# EAGLE design light_160mm_v1_0 (EAGLE 9.6.1)
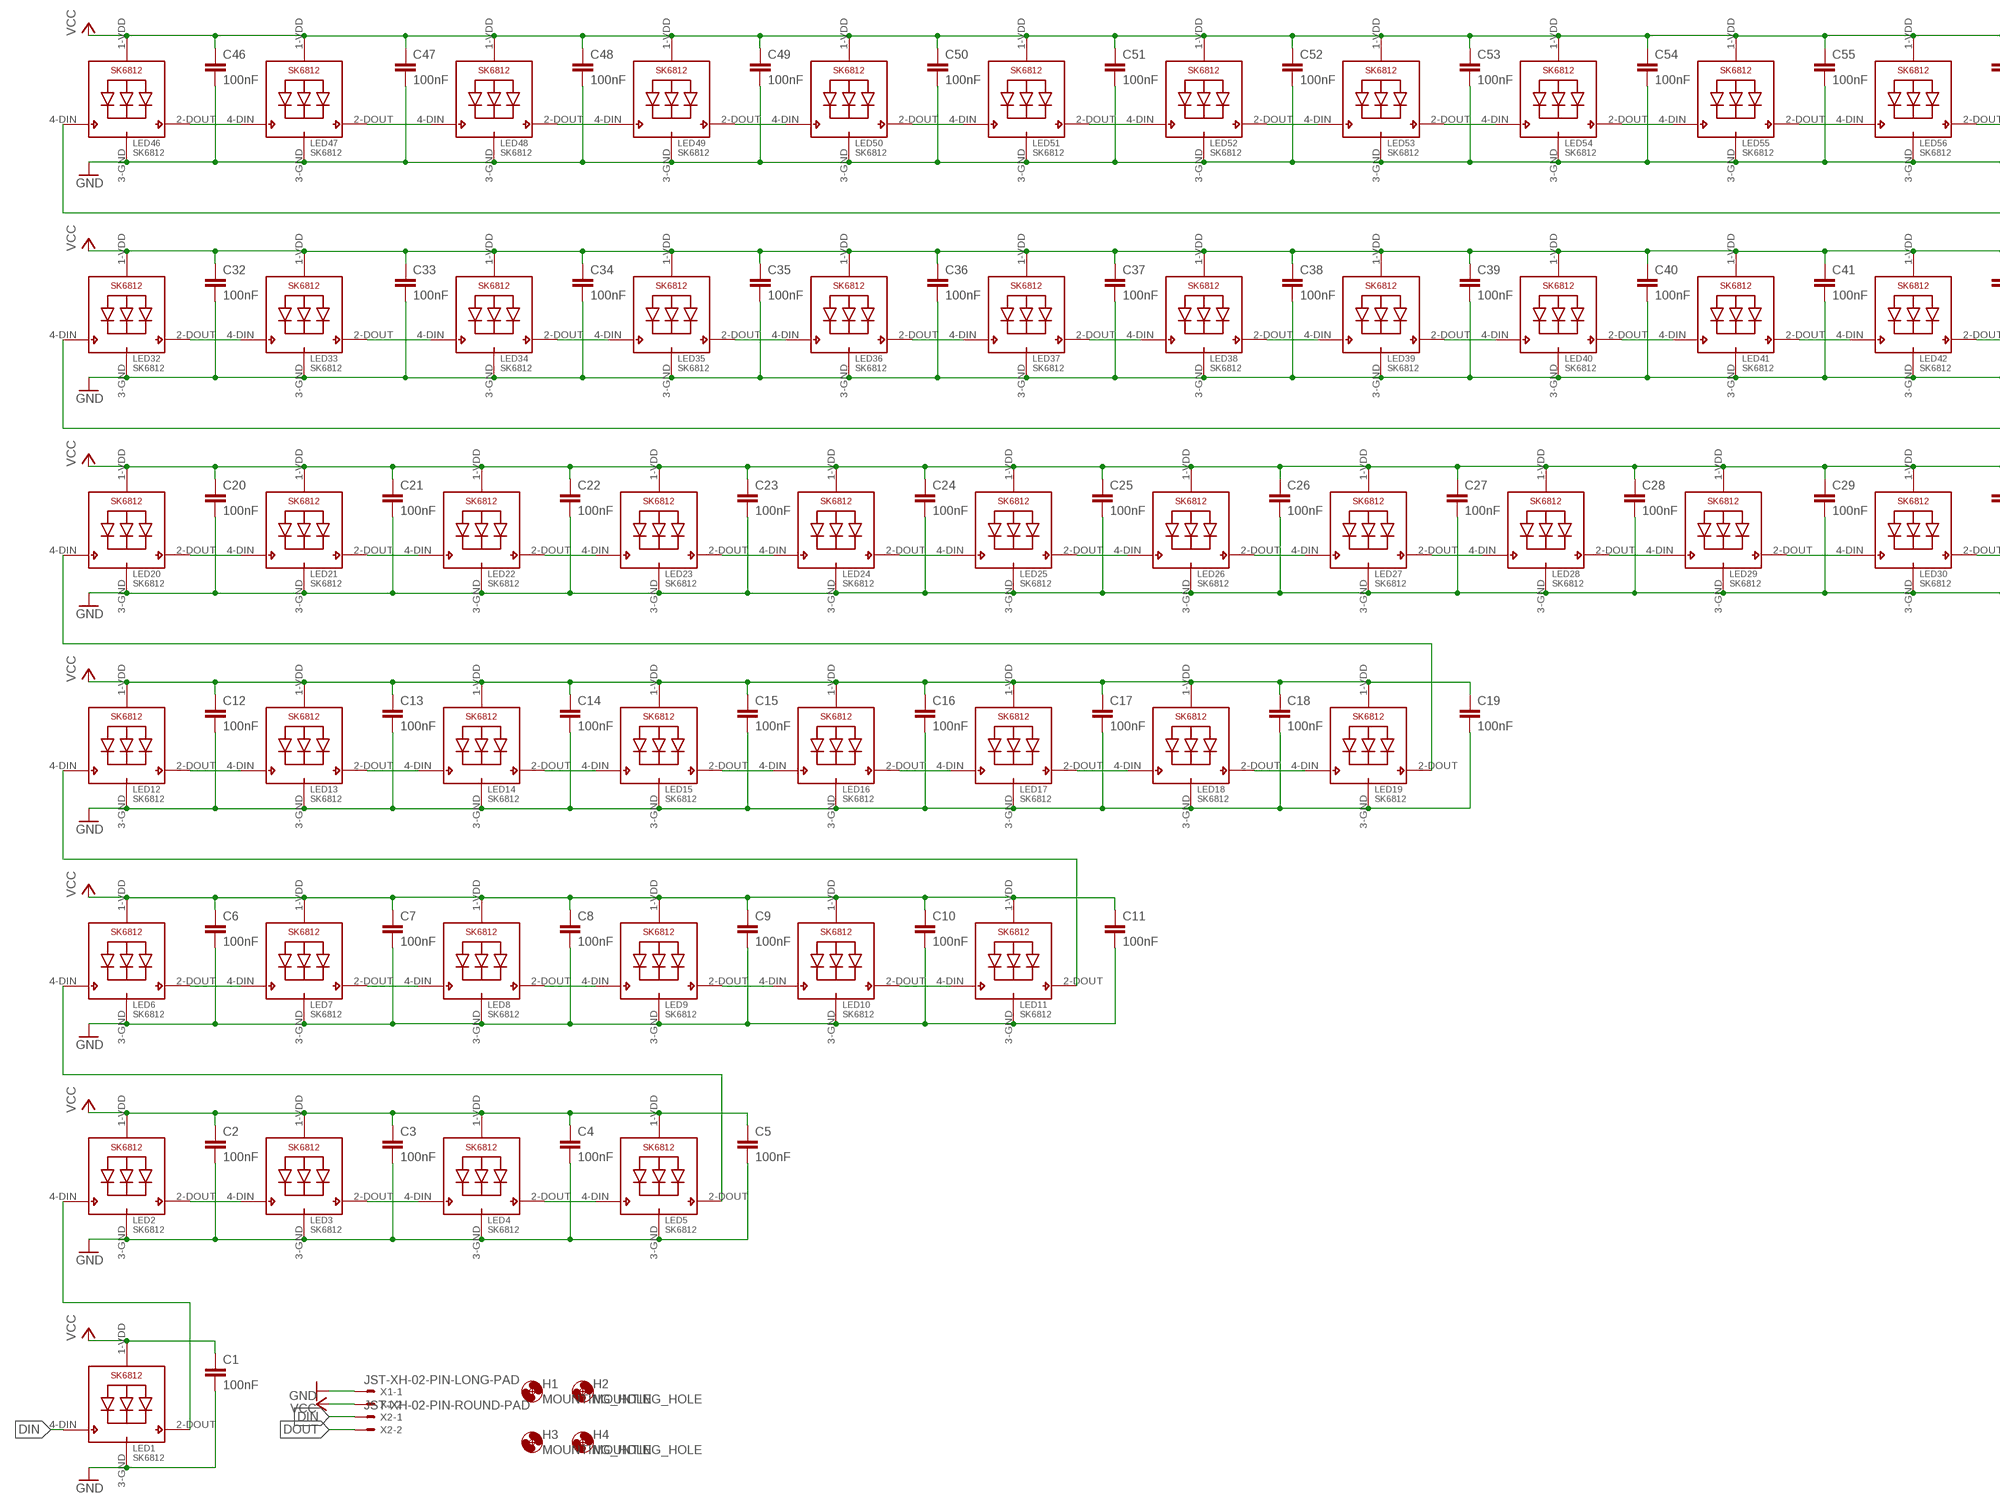
[diagram p0: schematic, sheet 1, part 1 of 2]
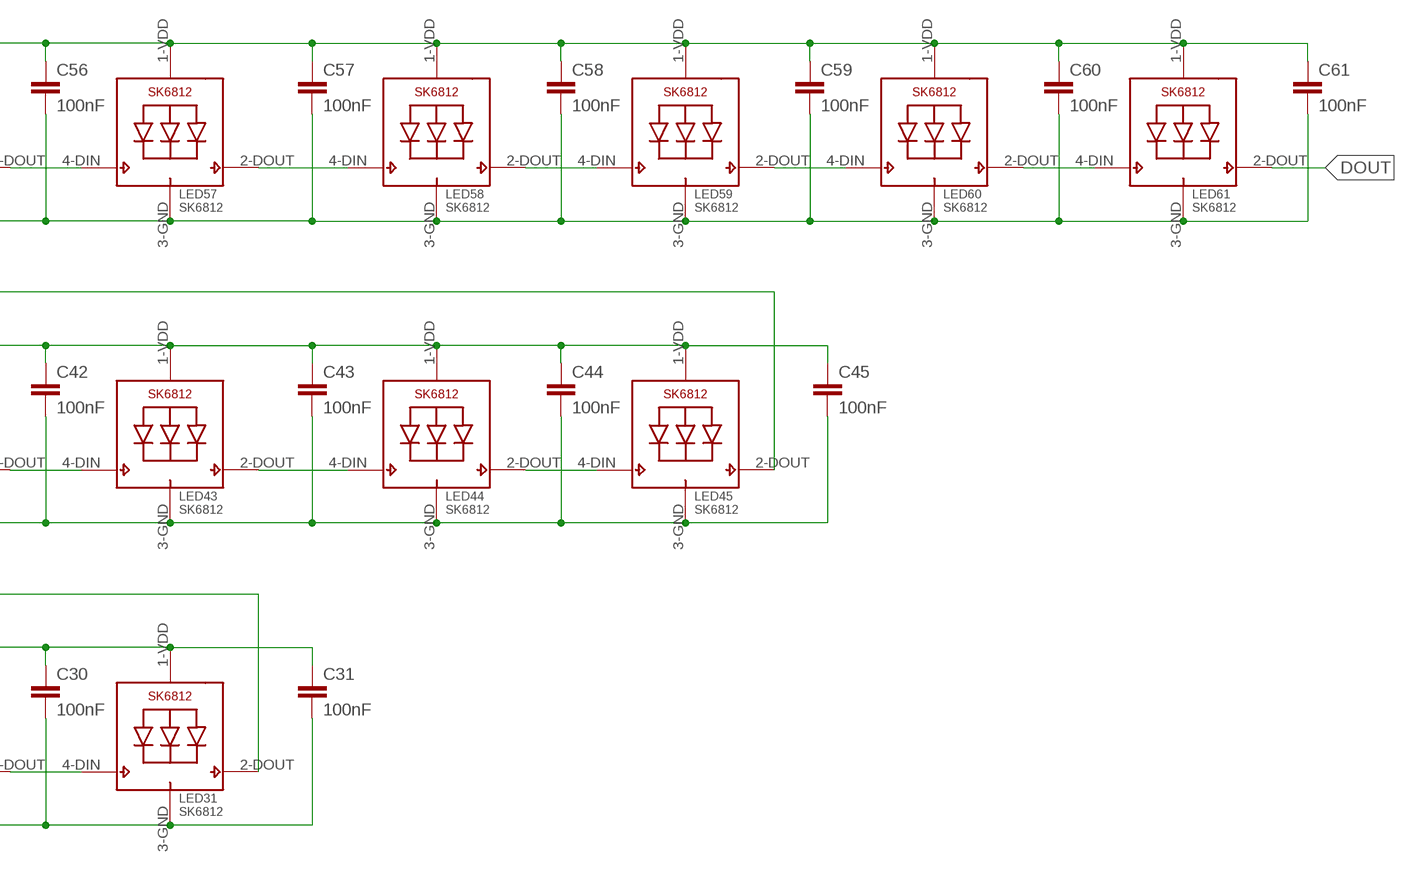
[diagram p1: schematic, sheet 1, part 2 of 2]

## Parts
C1  100nF  C-EUC0805  [C0805]
C2  100nF  C-EUC0805  [C0805]
C3  100nF  C-EUC0805  [C0805]
C4  100nF  C-EUC0805  [C0805]
C5  100nF  C-EUC0805  [C0805]
C6  100nF  C-EUC0805  [C0805]
C7  100nF  C-EUC0805  [C0805]
C8  100nF  C-EUC0805  [C0805]
C9  100nF  C-EUC0805  [C0805]
C10  100nF  C-EUC0805  [C0805]
C11  100nF  C-EUC0805  [C0805]
C12  100nF  C-EUC0805  [C0805]
C13  100nF  C-EUC0805  [C0805]
C14  100nF  C-EUC0805  [C0805]
C15  100nF  C-EUC0805  [C0805]
C16  100nF  C-EUC0805  [C0805]
C17  100nF  C-EUC0805  [C0805]
C18  100nF  C-EUC0805  [C0805]
C19  100nF  C-EUC0805  [C0805]
C20  100nF  C-EUC0805  [C0805]
C21  100nF  C-EUC0805  [C0805]
C22  100nF  C-EUC0805  [C0805]
C23  100nF  C-EUC0805  [C0805]
C24  100nF  C-EUC0805  [C0805]
C25  100nF  C-EUC0805  [C0805]
C26  100nF  C-EUC0805  [C0805]
C27  100nF  C-EUC0805  [C0805]
C28  100nF  C-EUC0805  [C0805]
C29  100nF  C-EUC0805  [C0805]
C30  100nF  C-EUC0805  [C0805]
C31  100nF  C-EUC0805  [C0805]
C32  100nF  C-EUC0805  [C0805]
C33  100nF  C-EUC0805  [C0805]
C34  100nF  C-EUC0805  [C0805]
C35  100nF  C-EUC0805  [C0805]
C36  100nF  C-EUC0805  [C0805]
C37  100nF  C-EUC0805  [C0805]
C38  100nF  C-EUC0805  [C0805]
C39  100nF  C-EUC0805  [C0805]
C40  100nF  C-EUC0805  [C0805]
C41  100nF  C-EUC0805  [C0805]
C42  100nF  C-EUC0805  [C0805]
C43  100nF  C-EUC0805  [C0805]
C44  100nF  C-EUC0805  [C0805]
C45  100nF  C-EUC0805  [C0805]
C46  100nF  C-EUC0805  [C0805]
C47  100nF  C-EUC0805  [C0805]
C48  100nF  C-EUC0805  [C0805]
C49  100nF  C-EUC0805  [C0805]
C50  100nF  C-EUC0805  [C0805]
C51  100nF  C-EUC0805  [C0805]
C52  100nF  C-EUC0805  [C0805]
C53  100nF  C-EUC0805  [C0805]
C54  100nF  C-EUC0805  [C0805]
C55  100nF  C-EUC0805  [C0805]
C56  100nF  C-EUC0805  [C0805]
C57  100nF  C-EUC0805  [C0805]
C58  100nF  C-EUC0805  [C0805]
C59  100nF  C-EUC0805  [C0805]
C60  100nF  C-EUC0805  [C0805]
C61  100nF  C-EUC0805  [C0805]
H1  MOUNTING_HOLE  [4,1]
H2  MOUNTING_HOLE  [4,1]
H3  MOUNTING_HOLE  [4,1]
H4  MOUNTING_HOLE  [4,1]
LED1  SK6812  SK6812_5050  [LED5050]
LED2  SK6812  SK6812_5050  [LED5050]
LED3  SK6812  SK6812_5050  [LED5050]
LED4  SK6812  SK6812_5050  [LED5050]
LED5  SK6812  SK6812_5050  [LED5050]
LED6  SK6812  SK6812_5050  [LED5050]
LED7  SK6812  SK6812_5050  [LED5050]
LED8  SK6812  SK6812_5050  [LED5050]
LED9  SK6812  SK6812_5050  [LED5050]
LED10  SK6812  SK6812_5050  [LED5050]
LED11  SK6812  SK6812_5050  [LED5050]
LED12  SK6812  SK6812_5050  [LED5050]
LED13  SK6812  SK6812_5050  [LED5050]
LED14  SK6812  SK6812_5050  [LED5050]
LED15  SK6812  SK6812_5050  [LED5050]
LED16  SK6812  SK6812_5050  [LED5050]
LED17  SK6812  SK6812_5050  [LED5050]
LED18  SK6812  SK6812_5050  [LED5050]
LED19  SK6812  SK6812_5050  [LED5050]
LED20  SK6812  SK6812_5050  [LED5050]
LED21  SK6812  SK6812_5050  [LED5050]
LED22  SK6812  SK6812_5050  [LED5050]
LED23  SK6812  SK6812_5050  [LED5050]
LED24  SK6812  SK6812_5050  [LED5050]
LED25  SK6812  SK6812_5050  [LED5050]
LED26  SK6812  SK6812_5050  [LED5050]
LED27  SK6812  SK6812_5050  [LED5050]
LED28  SK6812  SK6812_5050  [LED5050]
LED29  SK6812  SK6812_5050  [LED5050]
LED30  SK6812  SK6812_5050  [LED5050]
LED31  SK6812  SK6812_5050  [LED5050]
LED32  SK6812  SK6812_5050  [LED5050]
LED33  SK6812  SK6812_5050  [LED5050]
LED34  SK6812  SK6812_5050  [LED5050]
LED35  SK6812  SK6812_5050  [LED5050]
LED36  SK6812  SK6812_5050  [LED5050]
LED37  SK6812  SK6812_5050  [LED5050]
LED38  SK6812  SK6812_5050  [LED5050]
LED39  SK6812  SK6812_5050  [LED5050]
LED40  SK6812  SK6812_5050  [LED5050]
LED41  SK6812  SK6812_5050  [LED5050]
LED42  SK6812  SK6812_5050  [LED5050]
LED43  SK6812  SK6812_5050  [LED5050]
LED44  SK6812  SK6812_5050  [LED5050]
LED45  SK6812  SK6812_5050  [LED5050]
LED46  SK6812  SK6812_5050  [LED5050]
LED47  SK6812  SK6812_5050  [LED5050]
LED48  SK6812  SK6812_5050  [LED5050]
LED49  SK6812  SK6812_5050  [LED5050]
LED50  SK6812  SK6812_5050  [LED5050]
LED51  SK6812  SK6812_5050  [LED5050]
LED52  SK6812  SK6812_5050  [LED5050]
LED53  SK6812  SK6812_5050  [LED5050]
LED54  SK6812  SK6812_5050  [LED5050]
LED55  SK6812  SK6812_5050  [LED5050]
LED56  SK6812  SK6812_5050  [LED5050]
LED57  SK6812  SK6812_5050  [LED5050]
LED58  SK6812  SK6812_5050  [LED5050]
LED59  SK6812  SK6812_5050  [LED5050]
LED60  SK6812  SK6812_5050  [LED5050]
LED61  SK6812  SK6812_5050  [LED5050]
X1  JST-XH-02-PIN-LONG-PAD  [JST-XH-02-PACKAGE-LONG-PAD]
X2  JST-XH-02-PIN-ROUND-PAD  [JST-XH-02-PACKAGE-ROUND-PAD]

## Nets
DIN: LED1.4-DIN(DI) X2.1
DOUT: LED61.2-DOUT(DO) X2.2
GND: C1.2 C2.2 C3.2 C4.2 C5.2 C6.2 C7.2 C8.2 C9.2 C10.2 C11.2 C12.2 C13.2 C14.2 C15.2 C16.2 C17.2 C18.2 C19.2 C20.2 C21.2 C22.2 C23.2 C24.2 C25.2 C26.2 C27.2 C28.2 C29.2 C30.2 C31.2 C32.2 C33.2 C34.2 C35.2 C36.2 C37.2 C38.2 C39.2 C40.2 C41.2 C42.2 C43.2 C44.2 C45.2 C46.2 C47.2 C48.2 C49.2 C50.2 C51.2 C52.2 C53.2 C54.2 C55.2 C56.2 C57.2 C58.2 C59.2 C60.2 C61.2 LED1.3-GND(GND) LED2.3-GND(GND) LED3.3-GND(GND) LED4.3-GND(GND) LED5.3-GND(GND) LED6.3-GND(GND) LED7.3-GND(GND) LED8.3-GND(GND) LED9.3-GND(GND) LED10.3-GND(GND) LED11.3-GND(GND) LED12.3-GND(GND) LED13.3-GND(GND) LED14.3-GND(GND) LED15.3-GND(GND) LED16.3-GND(GND) LED17.3-GND(GND) LED18.3-GND(GND) LED19.3-GND(GND) LED20.3-GND(GND) LED21.3-GND(GND) LED22.3-GND(GND) LED23.3-GND(GND) LED24.3-GND(GND) LED25.3-GND(GND) LED26.3-GND(GND) LED27.3-GND(GND) LED28.3-GND(GND) LED29.3-GND(GND) LED30.3-GND(GND) LED31.3-GND(GND) LED32.3-GND(GND) LED33.3-GND(GND) LED34.3-GND(GND) LED35.3-GND(GND) LED36.3-GND(GND) LED37.3-GND(GND) LED38.3-GND(GND) LED39.3-GND(GND) LED40.3-GND(GND) LED41.3-GND(GND) LED42.3-GND(GND) LED43.3-GND(GND) LED44.3-GND(GND) LED45.3-GND(GND) LED46.3-GND(GND) LED47.3-GND(GND) LED48.3-GND(GND) LED49.3-GND(GND) LED50.3-GND(GND) LED51.3-GND(GND) LED52.3-GND(GND) LED53.3-GND(GND) LED54.3-GND(GND) LED55.3-GND(GND) LED56.3-GND(GND) LED57.3-GND(GND) LED58.3-GND(GND) LED59.3-GND(GND) LED60.3-GND(GND) LED61.3-GND(GND) X1.1
N$1: LED46.2-DOUT(DO) LED47.4-DIN(DI)
N$2: LED47.2-DOUT(DO) LED48.4-DIN(DI)
N$3: LED48.2-DOUT(DO) LED49.4-DIN(DI)
N$4: LED49.2-DOUT(DO) LED50.4-DIN(DI)
N$5: LED50.2-DOUT(DO) LED51.4-DIN(DI)
N$6: LED51.2-DOUT(DO) LED52.4-DIN(DI)
N$7: LED52.2-DOUT(DO) LED53.4-DIN(DI)
N$8: LED53.2-DOUT(DO) LED54.4-DIN(DI)
N$9: LED54.2-DOUT(DO) LED55.4-DIN(DI)
N$10: LED55.2-DOUT(DO) LED56.4-DIN(DI)
N$11: LED56.2-DOUT(DO) LED57.4-DIN(DI)
N$12: LED57.2-DOUT(DO) LED58.4-DIN(DI)
N$13: LED58.2-DOUT(DO) LED59.4-DIN(DI)
N$14: LED59.2-DOUT(DO) LED60.4-DIN(DI)
N$23: LED60.2-DOUT(DO) LED61.4-DIN(DI)
N$24: LED11.2-DOUT(DO) LED12.4-DIN(DI)
N$25: LED32.2-DOUT(DO) LED33.4-DIN(DI)
N$26: LED33.2-DOUT(DO) LED34.4-DIN(DI)
N$27: LED34.2-DOUT(DO) LED35.4-DIN(DI)
N$28: LED35.2-DOUT(DO) LED36.4-DIN(DI)
N$29: LED36.2-DOUT(DO) LED37.4-DIN(DI)
N$30: LED37.2-DOUT(DO) LED38.4-DIN(DI)
N$31: LED38.2-DOUT(DO) LED39.4-DIN(DI)
N$32: LED39.2-DOUT(DO) LED40.4-DIN(DI)
N$33: LED40.2-DOUT(DO) LED41.4-DIN(DI)
N$34: LED41.2-DOUT(DO) LED42.4-DIN(DI)
N$35: LED42.2-DOUT(DO) LED43.4-DIN(DI)
N$36: LED43.2-DOUT(DO) LED44.4-DIN(DI)
N$37: LED44.2-DOUT(DO) LED45.4-DIN(DI)
N$38: LED19.2-DOUT(DO) LED20.4-DIN(DI)
N$39: LED20.2-DOUT(DO) LED21.4-DIN(DI)
N$40: LED21.2-DOUT(DO) LED22.4-DIN(DI)
N$41: LED22.2-DOUT(DO) LED23.4-DIN(DI)
N$42: LED23.2-DOUT(DO) LED24.4-DIN(DI)
N$43: LED24.2-DOUT(DO) LED25.4-DIN(DI)
N$44: LED25.2-DOUT(DO) LED26.4-DIN(DI)
N$45: LED26.2-DOUT(DO) LED27.4-DIN(DI)
N$46: LED27.2-DOUT(DO) LED28.4-DIN(DI)
N$47: LED28.2-DOUT(DO) LED29.4-DIN(DI)
N$48: LED29.2-DOUT(DO) LED30.4-DIN(DI)
N$49: LED30.2-DOUT(DO) LED31.4-DIN(DI)
N$50: LED31.2-DOUT(DO) LED32.4-DIN(DI)
N$51: LED12.2-DOUT(DO) LED13.4-DIN(DI)
N$52: LED13.2-DOUT(DO) LED14.4-DIN(DI)
N$53: LED14.2-DOUT(DO) LED15.4-DIN(DI)
N$54: LED15.2-DOUT(DO) LED16.4-DIN(DI)
N$55: LED16.2-DOUT(DO) LED17.4-DIN(DI)
N$56: LED17.2-DOUT(DO) LED18.4-DIN(DI)
N$57: LED18.2-DOUT(DO) LED19.4-DIN(DI)
N$58: LED45.2-DOUT(DO) LED46.4-DIN(DI)
N$59: LED6.2-DOUT(DO) LED7.4-DIN(DI)
N$60: LED7.2-DOUT(DO) LED8.4-DIN(DI)
N$61: LED8.2-DOUT(DO) LED9.4-DIN(DI)
N$62: LED9.2-DOUT(DO) LED10.4-DIN(DI)
N$63: LED10.2-DOUT(DO) LED11.4-DIN(DI)
N$64: LED1.2-DOUT(DO) LED2.4-DIN(DI)
N$65: LED2.2-DOUT(DO) LED3.4-DIN(DI)
N$66: LED3.2-DOUT(DO) LED4.4-DIN(DI)
N$67: LED4.2-DOUT(DO) LED5.4-DIN(DI)
N$69: LED5.2-DOUT(DO) LED6.4-DIN(DI)
VCC: C1.1 C2.1 C3.1 C4.1 C5.1 C6.1 C7.1 C8.1 C9.1 C10.1 C11.1 C12.1 C13.1 C14.1 C15.1 C16.1 C17.1 C18.1 C19.1 C20.1 C21.1 C22.1 C23.1 C24.1 C25.1 C26.1 C27.1 C28.1 C29.1 C30.1 C31.1 C32.1 C33.1 C34.1 C35.1 C36.1 C37.1 C38.1 C39.1 C40.1 C41.1 C42.1 C43.1 C44.1 C45.1 C46.1 C47.1 C48.1 C49.1 C50.1 C51.1 C52.1 C53.1 C54.1 C55.1 C56.1 C57.1 C58.1 C59.1 C60.1 C61.1 LED1.1-VDD(VDD) LED2.1-VDD(VDD) LED3.1-VDD(VDD) LED4.1-VDD(VDD) LED5.1-VDD(VDD) LED6.1-VDD(VDD) LED7.1-VDD(VDD) LED8.1-VDD(VDD) LED9.1-VDD(VDD) LED10.1-VDD(VDD) LED11.1-VDD(VDD) LED12.1-VDD(VDD) LED13.1-VDD(VDD) LED14.1-VDD(VDD) LED15.1-VDD(VDD) LED16.1-VDD(VDD) LED17.1-VDD(VDD) LED18.1-VDD(VDD) LED19.1-VDD(VDD) LED20.1-VDD(VDD) LED21.1-VDD(VDD) LED22.1-VDD(VDD) LED23.1-VDD(VDD) LED24.1-VDD(VDD) LED25.1-VDD(VDD) LED26.1-VDD(VDD) LED27.1-VDD(VDD) LED28.1-VDD(VDD) LED29.1-VDD(VDD) LED30.1-VDD(VDD) LED31.1-VDD(VDD) LED32.1-VDD(VDD) LED33.1-VDD(VDD) LED34.1-VDD(VDD) LED35.1-VDD(VDD) LED36.1-VDD(VDD) LED37.1-VDD(VDD) LED38.1-VDD(VDD) LED39.1-VDD(VDD) LED40.1-VDD(VDD) LED41.1-VDD(VDD) LED42.1-VDD(VDD) LED43.1-VDD(VDD) LED44.1-VDD(VDD) LED45.1-VDD(VDD) LED46.1-VDD(VDD) LED47.1-VDD(VDD) LED48.1-VDD(VDD) LED49.1-VDD(VDD) LED50.1-VDD(VDD) LED51.1-VDD(VDD) LED52.1-VDD(VDD) LED53.1-VDD(VDD) LED54.1-VDD(VDD) LED55.1-VDD(VDD) LED56.1-VDD(VDD) LED57.1-VDD(VDD) LED58.1-VDD(VDD) LED59.1-VDD(VDD) LED60.1-VDD(VDD) LED61.1-VDD(VDD) X1.2

## Library data of the parts
C1-C61 = rcl:C-EU: CAPACITOR, European symbol; SPICEPREFIX: C
H1-H4 = ASeligmann:MOUNTING_HOLE: MOUNTING HOLE with drill center marker
LED1-LED61 = SK6812:SK6812
X1 X2 = ASeligmann:JST-XH-02-PIN: JST XH Connector 2 Pin Wire to board connector. Pitch: 2,54 mm, (0.100") Number of pins: 2 Created by Rembrandt Electronics www.rembrandtelectronics.com

## Board
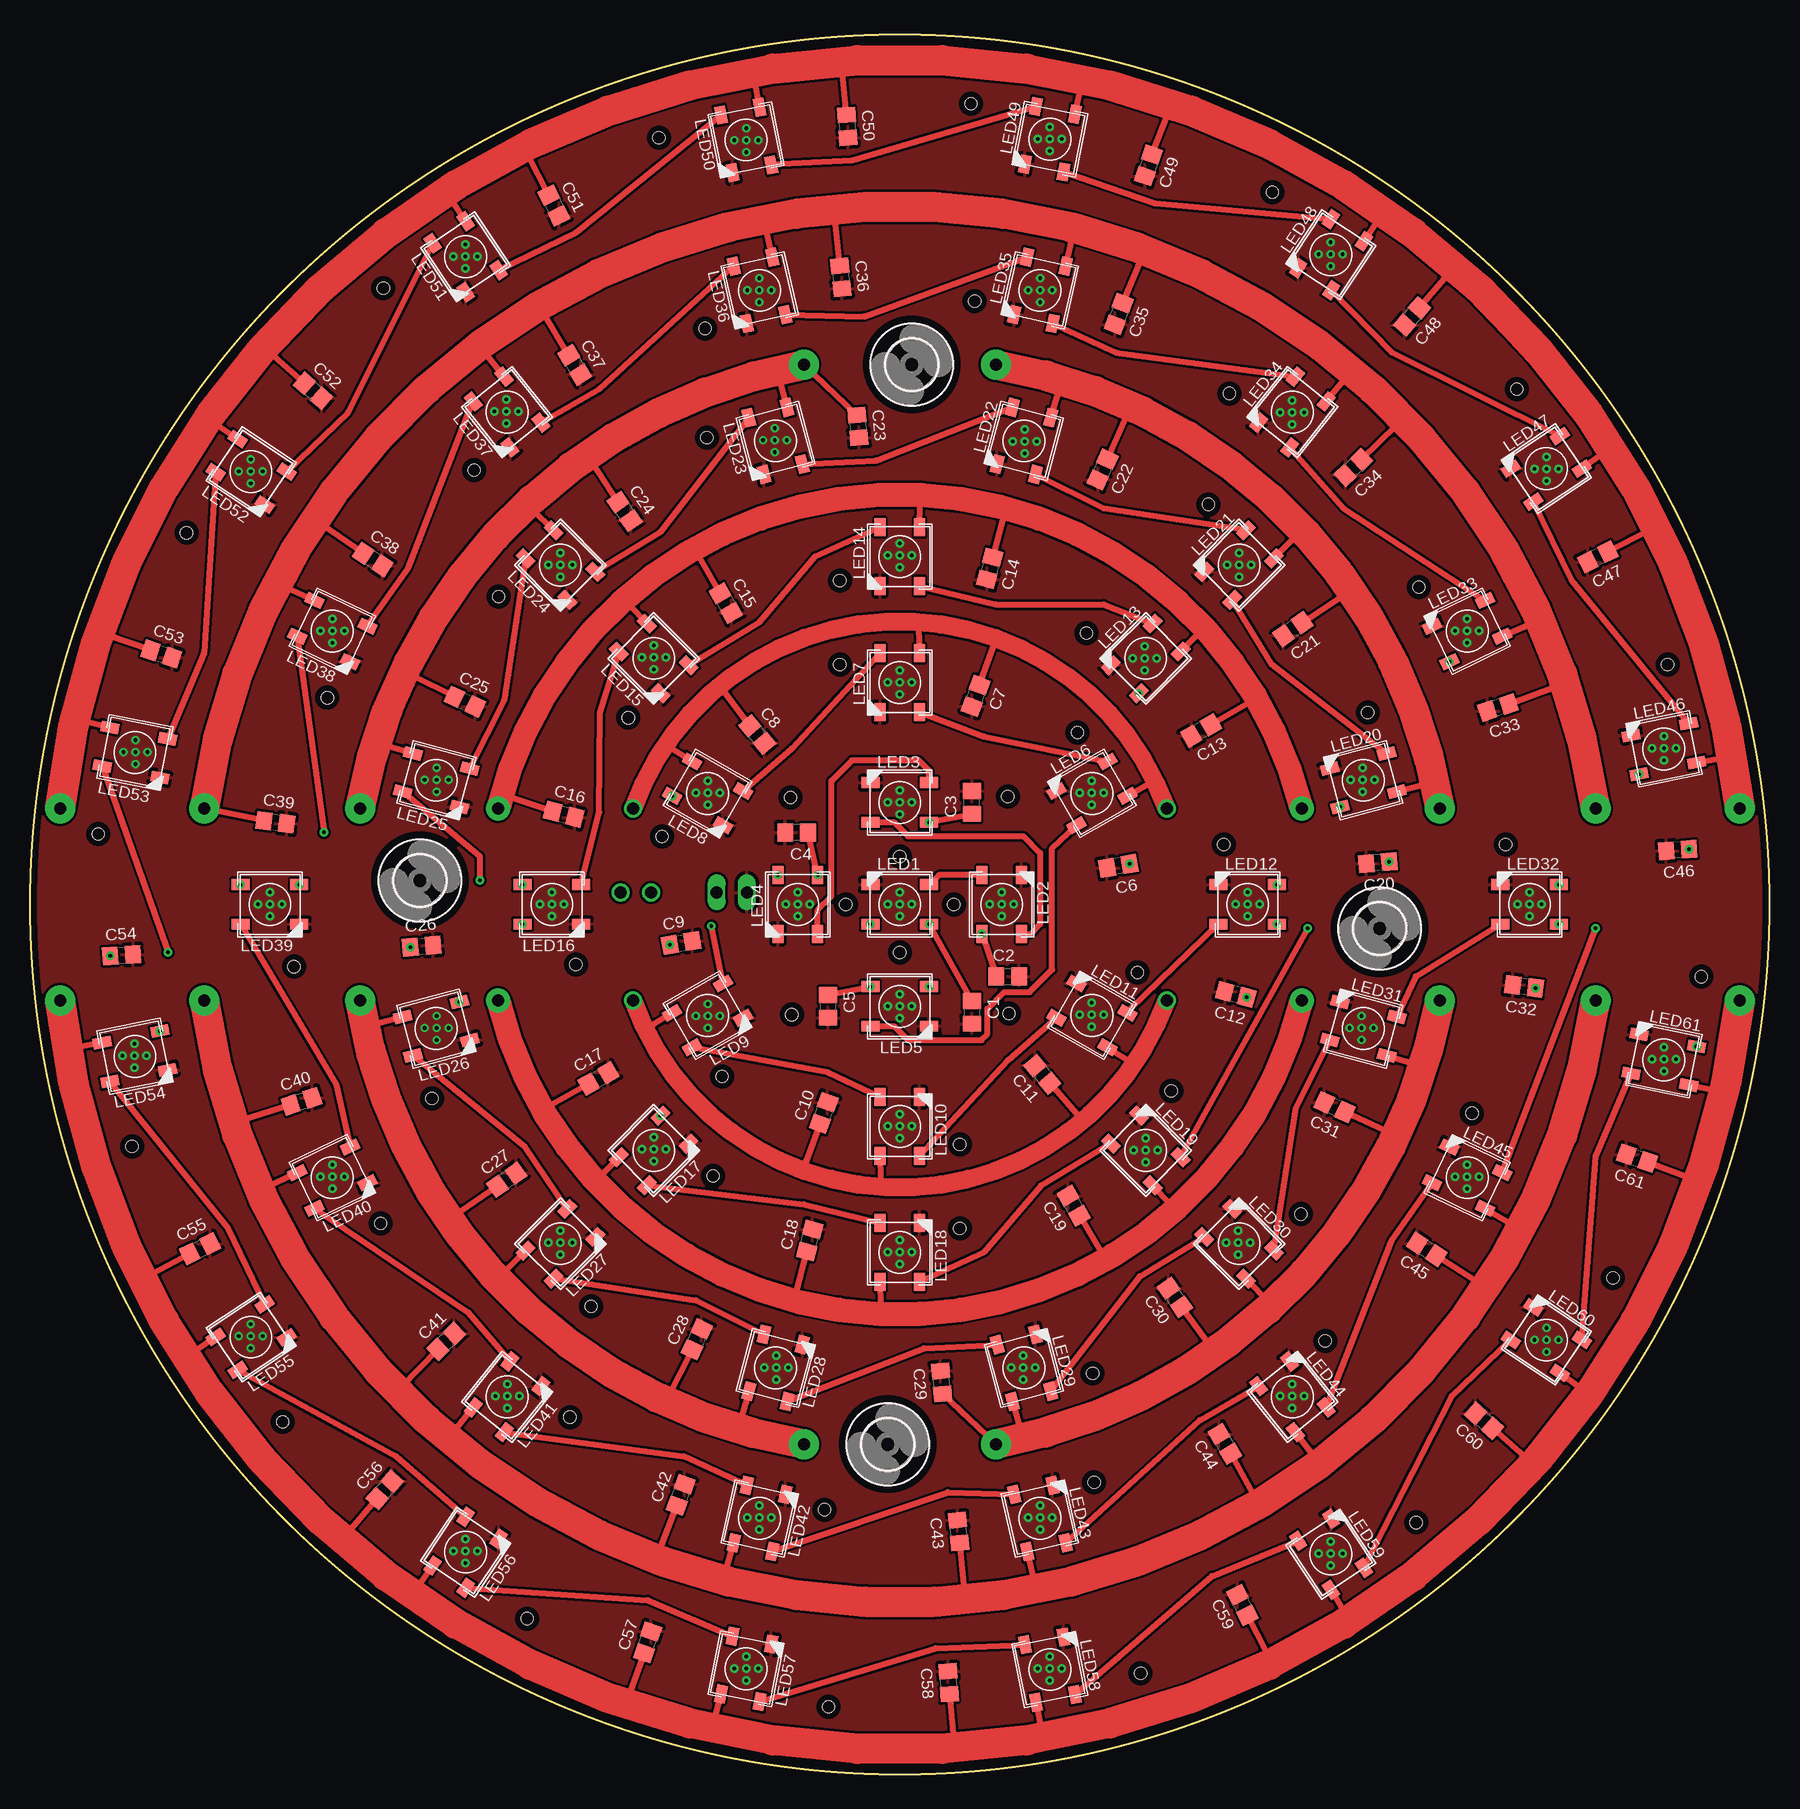
[diagram p2: board, top side]
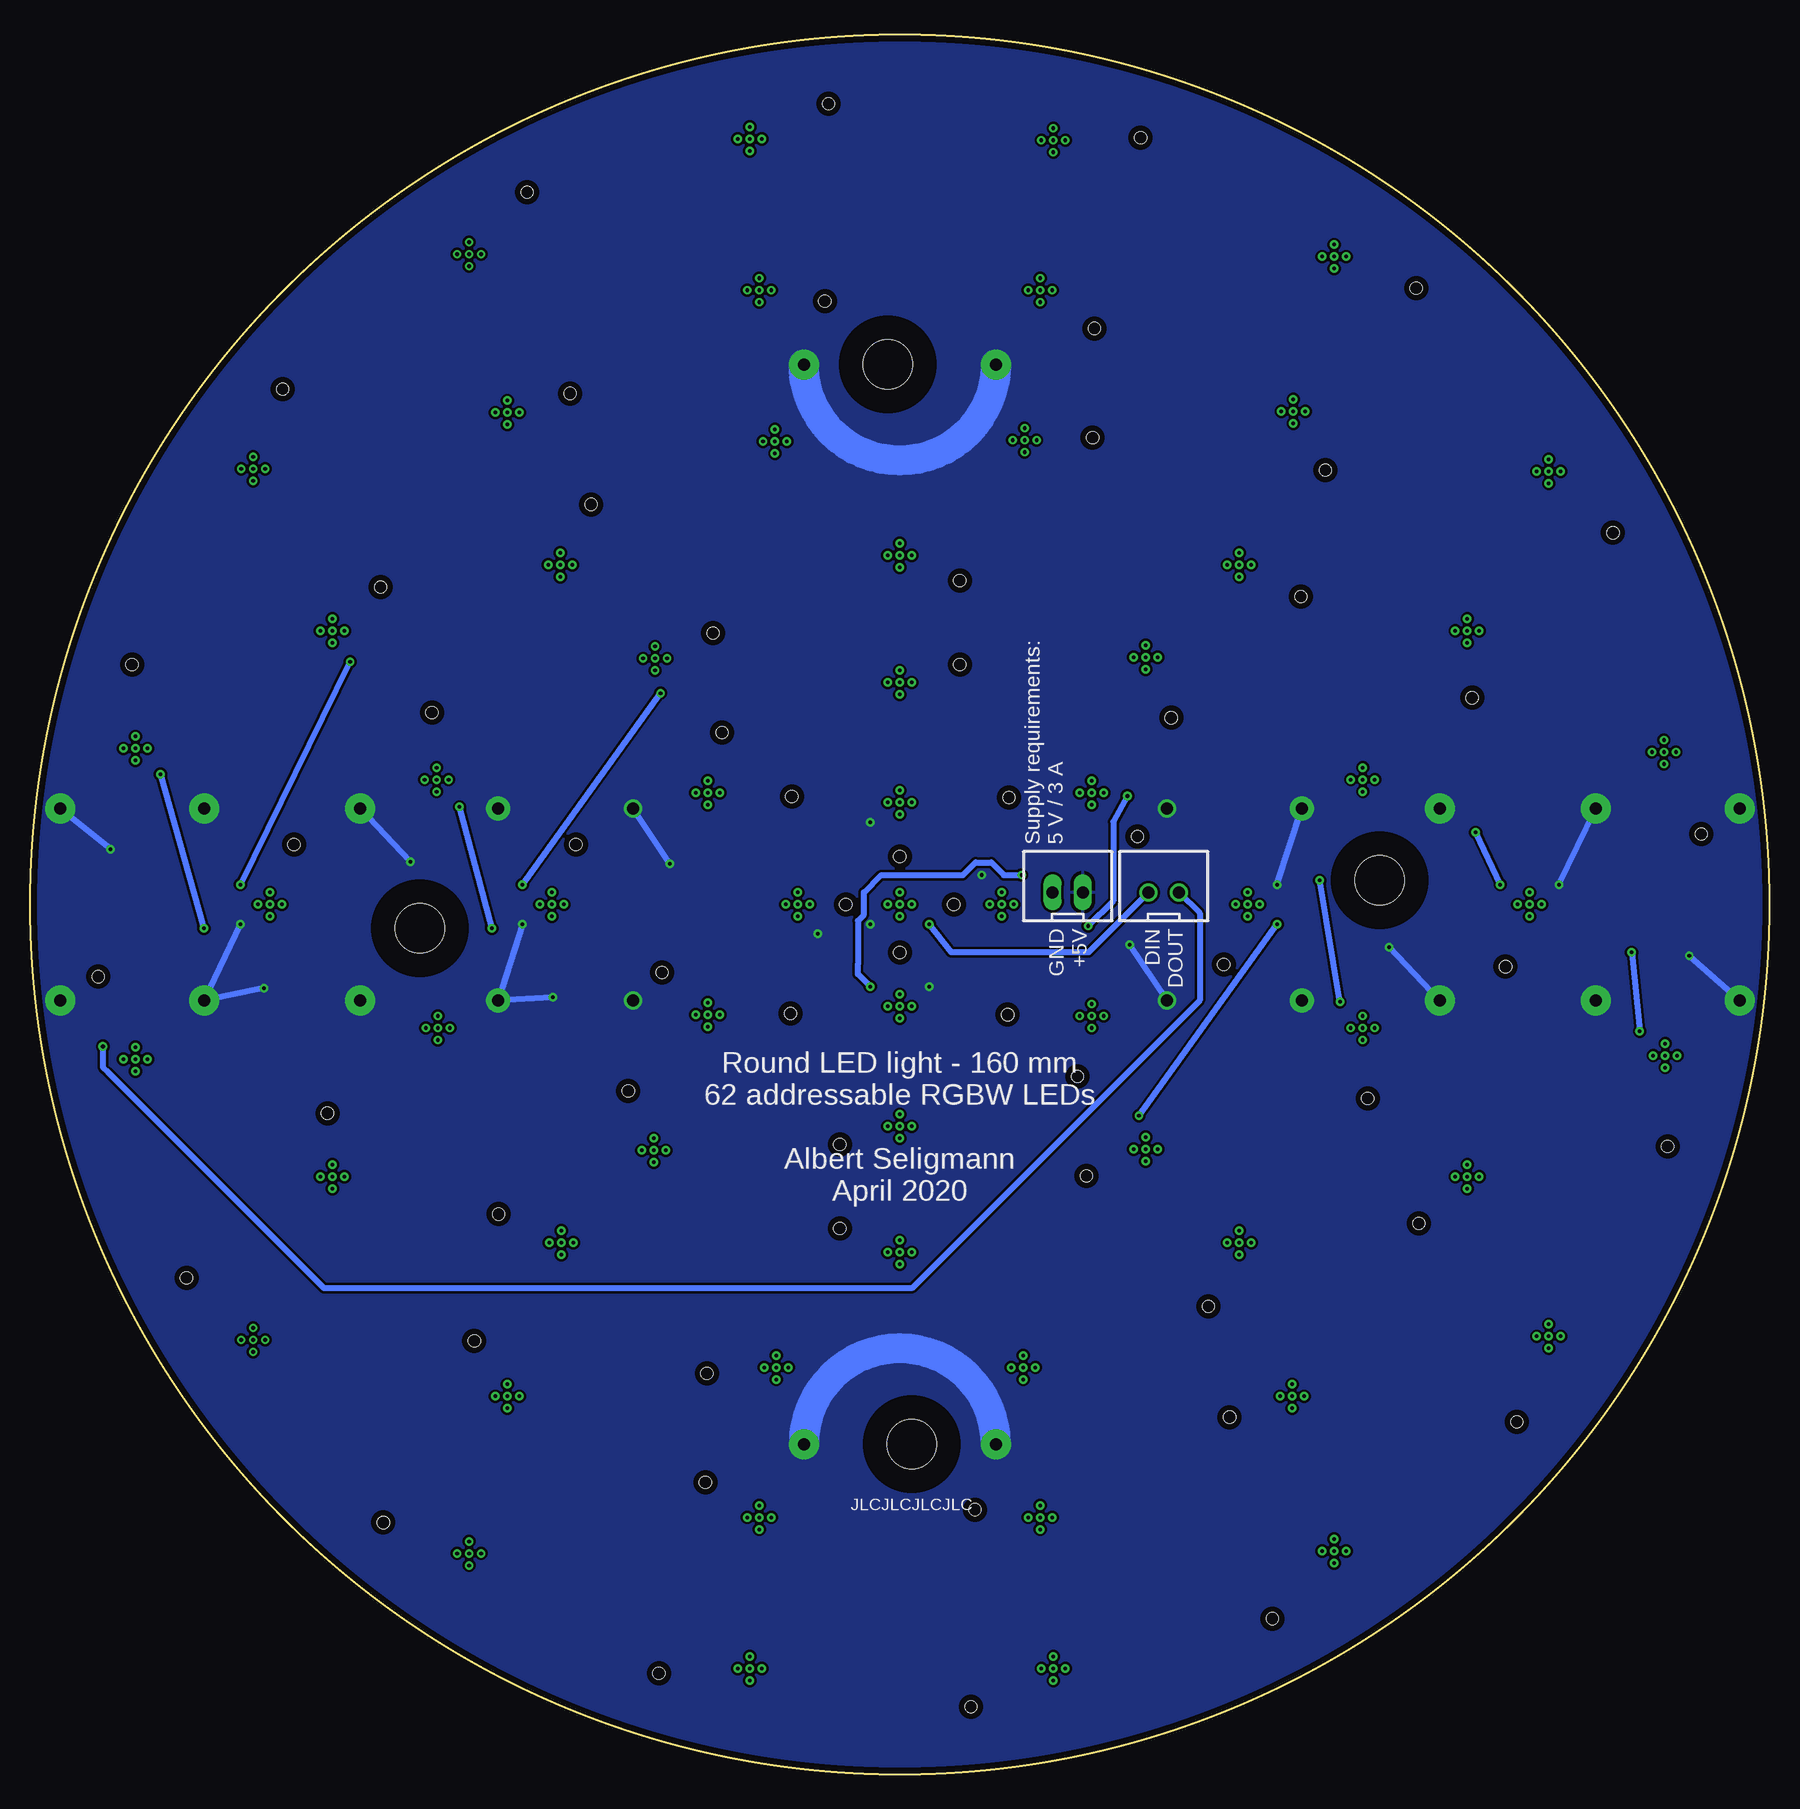
[diagram p3: board, bottom side, seen from below]

Size 145 x 145 mm. Coordinates in mm from the lower left corner, seen from the top.
Outline: circle at 72.5,72.5 radius 72.5
Copper layers (1*16): Top 0.035mm / dielectric 1.5mm / Bottom 0.035mm
Design rules "JLC_Vermilion2020": minimum track width 0.2mm, minimum drill 0.3mm, track to track 0.2mm, track to pad 0.3mm, pad to pad 0.3mm, via to via 0.2mm, smd to smd 0.2mm, copper to edge 0.5mm, drill to drill 0.25mm, minimum pad ring 0.2mm, minimum via ring 0.2mm, stop-mask expansion 0.055mm, vias tented up to drill 0.3mm, thermal gap 0.3mm
Holes 1 mm at 99.5,77.5 95.13,56.94 77.5,45.5 56.94,49.87 45.5,67.5 49.87,88.06 67.5,99.5 88.06,95.13 67.5,92.5 87.32,86.83 92.32,66.83 77.5,52.5 57.68,58.17 52.68,78.17 81.5,81.5 81.59,63.41 63.5,63.31 63.41,81.41 72.5,68.5 72.5,76.5 77,72.5 68,72.5 111.5,88.5 105.93,46.68 88.58,33.42 46.77,38.99 33.5,56.34 39.07,98.15 56.42,111.42 98.23,105.85 123,77.5 120.2,55.09 107.96,36.11 88.7,24.32 66.23,22.05 45,29.76 29.22,45.91 22,67.31 24.79,89.72 37.02,108.71 56.27,120.51 78.74,122.79 99.98,115.09 115.77,98.95 136.5,92.5 139.31,66.48 131.95,41.36 115.54,20.98 92.58,8.42 66.56,5.61 41.44,12.96 21.06,29.37 8.5,52.34 5.69,78.36 13.05,103.47 29.46,123.86 52.42,136.42 78.44,139.23 103.56,131.87 123.94,115.46

### Footprints (pad centres in the part's own frame; a part is rotated, then mirrored left to right if it is on the bottom)
C0805 = smd 1.3 x 1.5: 1 -0.95,0; 2 0.95,0
4,1 = hole 4.1: 0,0
LED5050 = smd 1.5 x 0.9: 1-VDD 2.45,-1.65; 2-DOUT 2.45,1.65; 3-GND -2.45,1.65; 4-DIN -2.45,-1.65
JST-XH-02-PACKAGE-LONG-PAD = drill 1 long: 1 -1.27,0; 2 1.27,0
JST-XH-02-PACKAGE-ROUND-PAD = drill 1: 1 -1.27,0; 2 1.27,0

### Placement (x,y rotation side)
C1  78.5,63.5 270 top
C2  81.5,66.5 0 top
C3  78.5,81 90 top
C4  63.9,78.5 180 top
C5  66.5,64 270 top
C6  90.72,75.71 190 top
C7  78.83,89.88 250 top
C8  60.61,86.67 310 top
C9  54.28,69.29 10 top
C10  66.17,55.12 70 top
C11  84.39,58.33 130 top
C12  100.51,64.99 165 top
C13  97.61,87 210 top
C14  80.01,100.51 255 top
C15  58,97.61 300 top
C16  44.49,80.01 345 top
C17  47.39,58 30 top
C18  64.99,44.49 75 top
C19  87,47.39 120 top
C20  112.35,75.99 185 top
C21  105.27,95.44 215 top
C22  89.4,108.75 245 top
C23  69.01,112.35 275 top
C24  49.56,105.27 305 top
C25  36.25,89.4 335 top
C26  32.65,69.01 5 top
C27  39.73,49.56 35 top
C28  55.6,36.25 65 top
C29  75.99,32.65 95 top
C30  95.44,39.73 125 top
C31  108.75,55.6 155 top
C32  124.55,65.65 172.5 top
C33  122.37,88.91 198.2 top
C34  110.31,108.92 223.9 top
C35  90.76,121.72 249.6 top
C36  67.6,124.77 275.4 top
C37  45.4,117.47 301.1 top
C38  28.58,101.26 326.8 top
C39  20.45,79.35 352.5 top
C40  22.63,56.09 18.2 top
C41  34.69,36.08 43.9 top
C42  54.24,23.28 69.6 top
C43  77.4,20.23 95.4 top
C44  99.6,27.53 121.1 top
C45  116.42,43.74 146.8 top
C46  137.34,77.03 184 top
C47  130.69,101.47 206.5 top
C48  115.2,121.51 229 top
C49  93.23,134.1 251.4 top
C50  68.12,137.35 273.9 top
C51  43.67,130.75 296.4 top
C52  23.59,115.31 318.8 top
C53  10.94,93.38 341.3 top
C54  7.64,68.27 3.7 top
C55  14.18,43.8 26.2 top
C56  29.57,23.69 48.7 top
C57  51.48,10.99 71.1 top
C58  76.58,7.63 93.6 top
C59  101.06,14.11 116.1 top
C60  121.21,29.46 138.5 top
C61  133.96,51.34 161 top
H1  71.5,27.5 0 top
H2  73.5,117.5 0 top
H3  112.5,70.5 0 top
H4  32.5,74.5 0 top
LED1  72.5,72.5 0 top
LED2  81,72.5 270 top
LED3  72.5,81 0 top
LED4  64,72.5 90 top
LED5  72.5,64 180 top
LED6  88.52,81.75 30 top
LED7  72.5,91 90 top
LED8  56.48,81.75 150 top
LED9  56.48,63.25 210 top
LED10  72.5,54 270 top
LED11  88.52,63.25 330 top
LED12  101.5,72.5 0 top
LED13  93.01,93.01 45 top
LED14  72.5,101.5 90 top
LED15  51.99,93.01 135 top
LED16  43.5,72.5 180 top
LED17  51.99,51.99 225 top
LED18  72.5,43.5 270 top
LED19  93.01,51.99 315 top
LED20  111.14,82.85 15 top
LED21  100.78,100.78 45 top
LED22  82.85,111.14 75 top
LED23  62.15,111.14 105 top
LED24  44.22,100.78 135 top
LED25  33.86,82.85 165 top
LED26  33.86,62.15 195 top
LED27  44.22,44.22 225 top
LED28  62.15,33.86 255 top
LED29  82.85,33.86 285 top
LED30  100.78,44.22 315 top
LED31  111.14,62.15 345 top
LED32  125,72.5 0 top
LED33  119.8,95.28 25.8 top
LED34  105.23,113.55 51.4 top
LED35  84.18,123.68 77.2 top
LED36  60.82,123.68 102.8 top
LED37  39.77,113.55 128.6 top
LED38  25.2,95.28 154.2 top
LED39  20,72.5 180 top
LED40  25.2,49.72 205.8 top
LED41  39.77,31.45 231.4 top
LED42  60.82,21.32 257.2 top
LED43  84.18,21.32 282.8 top
LED44  105.23,31.45 308.6 top
LED45  119.8,49.72 334.2 top
LED46  136.2,85.46 11.5 top
LED47  126.41,108.82 33.9 top
LED48  108.44,126.66 56.4 top
LED49  85.01,136.28 78.9 top
LED50  59.69,136.23 101.3 top
LED51  36.31,126.49 123.8 top
LED52  18.42,108.56 146.3 top
LED53  8.75,85.16 168.8 top
LED54  8.75,59.84 191.3 top
LED55  18.42,36.44 213.7 top
LED56  36.31,18.51 236.2 top
LED57  59.69,8.77 258.7 top
LED58  85.01,8.72 281.1 top
LED59  108.44,18.34 303.6 top
LED60  126.41,36.18 326.1 top
LED61  136.2,59.54 348.5 top
X1  58.5,73.5 0 bottom
X2  50.5,73.5 0 bottom

### Tracks (layer width: path | path; a pad name or v marks a point on that pad's centre or on a via)
DIN  (via drill 0.3 pad 0.6)
  Bottom 0.5: X2.1 56.77,68.5 68.19,68.5 LED1.4-DIN
  other vias: 70.05,70.85
DOUT  (via drill 0.35)
  Bottom 0.5: X2.2 47.5,71.77 47.5,64.5 71.5,40.5 120.5,40.5 138.5,58.5 138.93,58.92 LED61.2-DOUT
  other vias: 138.92,60.67
GND  (via drill 0.3 pad 0.6)
  other vias: 20,73.5 19,72.5 20,72.5 21,72.5 20,71.5 9.8,85.2 8.8,86.2 8.8,85.2 8.8,84.2 7.8,85.2 8.7,60.9 7.7,59.9 8.7,59.9 9.7,59.9 8.7,58.9 18.4,37.5 17.4,36.5 18.4,36.5 19.4,36.5 18.4,35.5 36.3,19.6 35.3,18.6 36.3,18.6 37.3,18.6 36.3,17.6 59.7,9.8 58.7,8.8 59.7,8.8 60.7,8.8 59.7,7.8 85,9.8 84,8.8 85,8.8 86,8.8 85,7.8 108.4,19.4 107.4,18.4 108.4,18.4 109.4,18.4 108.4,17.4 126.4,37.2 125.4,36.2 126.4,36.2 127.4,36.2 126.4,35.2 136.2,60.6 135.2,59.6 136.2,59.6 137.2,59.6 136.2,58.6 136.2,86.5 135.2,85.5 136.2,85.5 137.2,85.5 136.2,84.5 126.4,109.8 125.4,108.8 126.4,108.8 127.4,108.8 126.4,107.8 108.4,127.7 107.4,126.7 108.4,126.7 109.4,126.7 108.4,125.7 85,137.3 84,136.3 85,136.3 86,136.3 85,135.3 59.7,137.2 58.7,136.2 59.7,136.2 60.7,136.2 59.7,135.2 36.3,127.5 35.3,126.5 36.3,126.5 37.3,126.5 36.3,125.5 18.4,109.6 17.4,108.6 18.4,108.6 19.4,108.6 18.4,107.6 25.2,50.8 24.2,49.8 25.2,49.8 26.2,49.8 25.2,48.8 39.8,32.5 38.8,31.5 39.8,31.5 40.8,31.5 39.8,30.5 60.8,22.4 59.8,21.4 60.8,21.4 61.8,21.4 60.8,20.4 84.2,22.4 83.2,21.4 84.2,21.4 85.2,21.4 84.2,20.4 105.2,32.5 104.2,31.5 105.2,31.5 106.2,31.5 105.2,30.5 119.8,50.8 118.8,49.8 119.8,49.8 120.8,49.8 119.8,48.8 125,73.5 124,72.5 125,72.5 126,72.5 125,71.5 119.8,96.3 118.8,95.3 119.8,95.3 120.8,95.3 119.8,94.3 105.2,114.5 104.2,113.5 105.2,113.5 106.2,113.5 105.2,112.5 84.2,124.7 83.2,123.7 84.2,123.7 85.2,123.7 84.2,122.7 60.8,124.7 59.8,123.7 60.8,123.7 61.8,123.7 60.8,122.7 39.7,114.6 38.7,113.6 39.7,113.6 40.7,113.6 39.7,112.6 25.2,96.3 24.2,95.3 25.2,95.3 26.2,95.3 25.2,94.3 33.9,63.2 32.9,62.2 33.9,62.2 34.9,62.2 33.9,61.2 44.2,45.3 43.2,44.3 44.2,44.3 45.2,44.3 44.2,43.3 52,53.1 51,52.1 52,52.1 53,52.1 52,51.1 62.2,34.9 61.2,33.9 62.2,33.9 63.2,33.9 62.2,32.9 72.5,44.5 71.5,43.5 72.5,43.5 73.5,43.5 72.5,42.5 82.8,34.9 81.8,33.9 82.8,33.9 83.8,33.9 82.8,32.9 100.7,45.3 99.7,44.3 100.7,44.3 101.7,44.3 100.7,43.3 93,53 92,52 93,52 94,52 93,51 111,63.2 110,62.2 111,62.2 112,62.2 111,61.2 101.5,73.5 100.5,72.5 101.5,72.5 102.5,72.5 101.5,71.5 111.1,83.9 110.1,82.9 111.1,82.9 112.1,82.9 111.1,81.9 92.9,94 91.9,93 92.9,93 93.9,93 92.9,92 100.8,101.8 99.8,100.8 100.8,100.8 101.8,100.8 100.8,99.8 72.5,102.6 71.5,101.6 72.5,101.6 73.5,101.6 72.5,100.6 82.9,112.1 81.9,111.1 82.9,111.1 83.9,111.1 82.9,110.1 62.1,112.2 61.1,111.2 62.1,111.2 63.1,111.2 62.1,110.2 44.2,101.8 43.2,100.8 44.2,100.8 45.2,100.8 44.2,99.8 33.9,83.9 32.9,82.9 33.9,82.9 34.9,82.9 33.9,81.9 52,94.1 51,93.1 52,93.1 53,93.1 52,92.1 43.5,73.5 42.5,72.5 43.5,72.5 44.5,72.5 43.5,71.5 56.5,82.8 55.5,81.8 56.5,81.8 57.5,81.8 56.5,80.8 72.5,92 71.5,91 72.5,91 73.5,91 72.5,90 88.5,82.8 87.5,81.8 88.5,81.8 89.5,81.8 88.5,80.8 72.5,82 71.5,81 72.5,81 73.5,81 72.5,80 81,73.5 80,72.5 81,72.5 82,72.5 81,71.5 72.5,73.5 71.5,72.5 72.5,72.5 73.5,72.5 72.5,71.5 64,73.5 63,72.5 64,72.5 65,72.5 64,71.5 72.5,65 71.5,64 72.5,64 73.5,64 72.5,63 56.5,64.2 55.5,63.2 56.5,63.2 57.5,63.2 56.5,62.2 72.5,55 71.5,54 72.5,54 73.5,54 72.5,53 88.5,64.3 87.5,63.3 88.5,63.3 89.5,63.3 88.5,62.3
  pour Top: 72.5,152.5 arc-180 72.5,-7.5 arc-180
N$1
  Top 0.5: LED46.2-DOUT 128.5,99.5 LED47.4-DIN
N$2
  Top 0.5: LED47.2-DOUT 113.5,118.5 LED48.4-DIN
N$3
  Top 0.5: LED49.4-DIN 93.75,130.95 LED48.2-DOUT
N$4
  Top 0.5: LED49.2-DOUT 68.5,134.5 LED50.4-DIN
N$5
  Top 0.5: LED50.2-DOUT 45.5,128.5 LED51.4-DIN
N$6
  Top 0.5: LED51.2-DOUT 26.5,113.5 LED52.4-DIN
N$7
  Top 0.5: LED52.2-DOUT 14.5,93.5 LED53.4-DIN
N$8  (via drill 0.3 pad 0.6)
  Top 0.5: LED53.2-DOUT v11.5,68.5
  Bottom 0.5: v11.5,68.5 LED54.4-DIN
  other vias: 10.82,61.94
N$9
  Top 0.5: LED54.2-DOUT 16.5,45.5 LED55.4-DIN
N$10
  Top 0.5: LED55.2-DOUT 30.5,26.5 LED56.4-DIN
N$11
  Top 0.5: LED56.2-DOUT 51.5,14.5 LED57.4-DIN
N$12
  Top 0.5: LED57.2-DOUT 75.5,10.5 LED58.4-DIN
N$13
  Top 0.5: LED58.2-DOUT 98.5,16.5 LED59.4-DIN
N$14
  Top 0.5: LED59.2-DOUT 118.5,31.5 LED60.4-DIN
N$23
  Top 0.5: LED60.2-DOUT 130.5,51.5 LED61.4-DIN
N$24
  Top 0.5: LED11.2-DOUT 91.69,63.73 LED12.4-DIN
N$25  (via drill 0.3 pad 0.6)
  Bottom 0.5: LED32.2-DOUT LED33.4-DIN
  other vias: 127.45,74.15 118.31,92.73
N$26
  Top 0.5: LED34.4-DIN 109.5,105.5 LED33.2-DOUT
N$27
  Top 0.5: LED35.4-DIN 90.5,118.5 LED34.2-DOUT
N$28
  Top 0.5: LED36.4-DIN 69.5,121.5 LED35.2-DOUT
N$29
  Top 0.5: LED37.4-DIN 47.5,115.5 LED36.2-DOUT
N$30
  Top 0.5: LED38.4-DIN 31.5,100.5 LED37.2-DOUT
N$31  (via drill 0.3 pad 0.6)
  Top 0.5: LED38.2-DOUT v24.5,78.5
  Bottom 0.5: v24.5,78.5 LED39.4-DIN
  other vias: 22.45,74.15
N$32
  Top 0.5: LED39.2-DOUT 25.5,57.5 LED40.4-DIN
N$33
  Top 0.5: LED40.2-DOUT 36.5,38.5 LED41.4-DIN
N$34
  Top 0.5: LED41.2-DOUT 54.5,26.5 LED42.4-DIN
N$35
  Top 0.5: LED42.2-DOUT 76.5,23.5 LED43.4-DIN
N$36
  Top 0.5: LED43.2-DOUT 97.5,29.5 LED44.4-DIN
N$37
  Top 0.5: LED44.2-DOUT 113.5,44.5 LED45.4-DIN
N$38  (via drill 0.3 pad 0.6)
  Top 0.5: LED19.2-DOUT v106.5,70.5
  Bottom 0.5: v106.5,70.5 LED20.4-DIN
  other vias: 109.2,80.62
N$39
  Top 0.5: LED20.2-DOUT 103.5,92.5 LED21.4-DIN
N$40
  Top 0.5: LED21.2-DOUT 89.5,105.5 LED22.4-DIN
N$41
  Top 0.5: LED23.4-DIN 70.5,109.5 LED22.2-DOUT
N$42
  Top 0.5: LED23.2-DOUT 52.5,103.5 LED24.4-DIN
N$43
  Top 0.5: LED24.2-DOUT 39.5,89.5 LED25.4-DIN
N$44  (via drill 0.3 pad 0.6)
  Top 0.5: v37.5,74.5 37.5,76.5 LED25.2-DOUT
  Bottom 0.5: LED26.4-DIN v37.5,74.5
  other vias: 35.8,64.38
N$45
  Top 0.5: LED27.4-DIN 41.25,52.3 LED26.2-DOUT
N$46
  Top 0.5: LED27.2-DOUT 55.5,39.5 LED28.4-DIN
N$47
  Top 0.5: LED28.2-DOUT 74.5,35.5 LED29.4-DIN
N$48
  Top 0.5: LED29.2-DOUT 92.5,41.5 LED30.4-DIN
N$49
  Top 0.5: LED30.2-DOUT 105.5,55.5 LED31.4-DIN
N$50
  Top 0.5: LED31.2-DOUT 115.5,66.5 LED32.4-DIN
N$51  (via drill 0.3 pad 0.6)
  Bottom 0.5: LED12.2-DOUT LED13.4-DIN
  other vias: 103.95,74.15 92.44,90.11
N$52
  Top 0.5: LED14.4-DIN 80.55,97.5 89.5,97.5 LED13.2-DOUT
N$53
  Top 0.5: LED15.4-DIN 60.8,96.05 65.45,101.5 LED14.2-DOUT
N$54
  Top 0.5: LED16.4-DIN 47.45,80.2 47.5,88.5 LED15.2-DOUT
N$55  (via drill 0.3 pad 0.6)
  Bottom 0.5: LED16.2-DOUT LED17.4-DIN
  other vias: 41.05,70.85 52.56,54.89
N$56
  Top 0.5: LED17.2-DOUT 64.5,47.5 LED18.4-DIN
N$57
  Top 0.5: LED19.4-DIN 84.25,49.05 79.5,43.5 LED18.2-DOUT
N$58  (via drill 0.3 pad 0.6)
  Top 0.5: LED45.2-DOUT v130.5,70.5
  Bottom 0.5: v130.5,70.5 LED46.4-DIN
  other vias: 134.12,83.35
N$59
  Top 0.5: LED7.4-DIN 79.5,86.5 LED6.2-DOUT
N$60
  Top 0.5: LED8.4-DIN 63.5,85.5 LED7.2-DOUT
N$61  (via drill 0.3 pad 0.6, 0.35)
  Top 0.5: LED9.4-DIN v56.8,70.7
  Bottom 0.5: v56.8,70.7 54.7,72.8 54.7,79.4 LED8.2-DOUT
  other vias: 53.53,81.55
N$62
  Top 0.5: LED10.4-DIN 66.5,58.5 LED9.2-DOUT
N$63
  Top 0.5: LED11.4-DIN 81.5,59.5 LED10.2-DOUT
N$64
  Top 0.5: LED2.4-DIN 75.75,74.95 LED1.2-DOUT
N$65
  Top 0.5: LED2.2-DOUT 83.4,70.05 84.2,70.85 84.2,76.8 82.8,78.2 73.17,78.2 72.02,79.35 LED3.4-DIN
N$66
  Top 0.5: LED4.4-DIN 65.65,72.02 66.8,73.17 66.8,82.8 68.5,84.5 74.1,84.5 74.95,83.65 LED3.2-DOUT
N$67  (via drill 0.3 pad 0.6)
  Bottom 0.5: LED4.2-DOUT 63.82,74.95 64.87,76 66.18,76 67.23,74.95 74.05,74.95 75.5,73.5 75.5,71.63 76,71.13 76,67.5 76,66.7 LED5.4-DIN
  other vias: 74.95,65.65 62.35,74.95
N$69
  Top 0.5: LED5.2-DOUT 72.02,62.35 73.17,61.2 79.33,61.2 79.8,61.67 79.8,63.8 81.2,65.2 83.33,65.2 85.2,67.07 85.2,77.16 LED6.4-DIN
VCC  (via drill 0.3 pad 0.6, 1 pad 1.5, 1 pad 2, 1 pad 2.5)
  Top 0: v27.5,80.5 29.5,84.5 29.89,85.67 30.5,87.5 31.94,91.52 32,91.7 34.2,95.9 38.7,101.9 41.87,105.44 42.2,105.8 46.87,109.38 | 46.67,109.68 50.7,111.6 55.5,113.9 59.9,115.6 62.5,116.2 | v80.5,117.5 82.6,116.1 85.7,115.4 85.82,115.35 91.39,113.18 91.6,113.1 98.4,109.3 105.6,103.3 109.4,98.2 113,92.4 116.3,82.6 116.35,82.51 v117.5,80.5 | v130.5,80.5 127.2,90.6 127.17,90.68 125.22,95.97 125.1,96.3 121.3,103.5 114,112.4 113.95,112.45 109.7,116.4 109.6,116.5 102.7,121.5 92.74,126.48 92.5,126.6 90.1,127.2 86.9,128.1 73.1,129.9 67.11,129.6 67.1,129.6 61.31,129 61.3,129 48.6,124.7 43,121.8 42.86,121.71 38.1,118.6 37.94,118.45 30.2,111.4 25.4,105.7 24.44,104.07 24.4,104 21.3,99 21.29,98.97 17,87.6 v14.5,80.5 | 112.5,129.8 111,130.7 104.9,134.1 94.9,138.5 87.59,140.57 87.5,140.6 80,141.7 67.8,142.2 67.7,142.19 60.44,141.11 60.4,141.1 51.2,138.8 41.6,135 41.52,134.96 35.1,131.3 28.9,127 20.1,118.6 20.02,118.49 15.5,112.6 15.45,112.53 12.2,107.5 6.5,94.9 4.51,87.73 v2.5,80.5 | v142.5,80.5 141.1,84.6 138.5,94.9 134.9,103.6 | v142.5,80.5 133.9,108.7 131.2,110.1 | v142.5,80.5 141.48,84.79 137.4,101.9 129,113.3 118.2,125 | v39,80.5 40.1,81.1 40.17,81.35 41.4,85.7 43.6,89.8 46.9,94.5 49.8,97.3 49.96,97.41 55.77,101.51 55.9,101.6 61.1,104 66.9,105.4 71.5,105.9 74.2,105.9 81.1,104.7 81.13,104.69 86.2,103 89.9,101.1 93,99.2 97.4,95.09 97.5,95 100.3,91.3 101.67,89.38 101.8,89.2 v106,80.5 | v50.25,80.5 52.3,85.2 53.54,85.46 | 52.92,85.87 57.45,90.8 | 57.57,90.64 64.3,95.07 71.5,96.4 74.07,96.4 | 74.1,96.4 78.9,95.4 80.62,94.91 | 80.48,94.51 81.33,94.28 81.89,93.73 82.5,93.5 83.5,93.5 84.5,92.5 85.5,92.5 87.5,90.5 89.5,88.5 90.5,87.5 90.76,87.24 91.76,86.39 93.6,83.4 93.76,82.88 94.2,82.5 v94.75,80.5
  Top 0: v50.25,64.5 51.8,62.6 51.91,62.43 | 51.45,62.14 55.1,56.47 61.98,51.22 64.36,50.23 | 64.51,50.65 70.8,49.6 70.89,49.61 | 70.91,48.61 76.9,49 82.65,51.01 87.76,54.47 88.2,55.1 91.5,58.3 92,59.2 | v39,64.5 41.2,59.9 43.4,55.8 43.42,55.77 45,53.1 47.7,50 50.7,46.9 56.1,43.3 62.4,40.6 63.86,40.21 63.9,40.2 69.4,39.1 70.9,39 78.3,39.4 83.5,40.8 87.2,42.3 89.38,43.34 89.5,43.4 92.5,45.5 95.06,47.55 97.5,49.5 102.5,55.5 105.62,63.52 v106,64.5 | v117.5,64.5 115.56,59.18 113.5,53.5 113.46,53.4 111.5,48.5 103.5,39.5 103.29,39.33 98.5,35.5 86.5,29.5 82.69,28.23 v80.5,27.5 | v64.5,27.5 62.5,27.5 59.03,28.8 54.5,30.5 53.06,31.22 48.5,33.5 42.5,38.5 39,41.3 37.5,42.5 34.66,46.05 33.5,47.5 30.5,53.5 28.5,59.5 27.94,62.29 v27.5,64.5 | v14.5,64.5 17.63,54.47 19.41,48.77 19.5,48.5 22.5,42.5 30.5,32.5 30.94,32.15 35.34,28.63 35.5,28.5 40.5,23.5 52.41,18.54 52.5,18.5 57.5,16.5 57.8,16.4 60.5,15.5 77.5,14.5 77.95,14.58 83.5,15.5 83.83,15.58 95.5,18.5 102.39,22.52 107.5,25.5 109.45,27.45 109.5,27.5 121.5,40.5 122.24,41.73 124.4,45.34 124.5,45.5 v130.5,64.5 | v142.5,64.5 141.54,56.81 141.5,56.5 138.95,49.48 137.5,45.5 129.7,31.85 129.5,31.5 125.5,26.5 125,26.07 109.92,12.87 109.5,12.5 103.8,8.7 103.5,8.5 84.53,2.51 84.5,2.5 77,2.5 76.5,2.5 56.71,3.49 56.5,3.5 49.5,5.5 31.5,14.5 27.5,18.5 26.5,19.5 13.5,34.5 13.26,34.92 9.57,41.38 9.5,41.5 3.5,60.5 v2.5,64.5
  Top 0.5: LED11.1-VDD 92,59.2 v94.75,64.5 | LED2.1-VDD C2.1 | C3.1 LED3.1-VDD 74.97,79.31 | C5.1 LED5.1-VDD | 134.9,103.6 C47.1 | 131.2,110.1 LED47.1-VDD | C48.1 118.2,125 | 112.5,129.8 LED48.1-VDD | C24.1 46.87,109.38 46.67,109.68 | LED8.1-VDD 53.54,85.46 52.92,85.87 | C8.1 57.9,90.2 | 57.9,90.2 57.45,90.8 | 57.9,90.2 57.57,90.64 | LED6.1-VDD 93.76,82.88 | LED9.1-VDD 51.91,62.43 51.45,62.14 | C10.1 64.68,51.1 | 64.68,51.1 64.51,50.65 | 64.68,51.1 64.36,50.23 | LED10.1-VDD 70.89,49.61 70.91,48.61 | C11.1 87.76,54.47 | C13.1 101.67,89.38 | LED13.1-VDD 97.4,95.09 | C14.1 81.13,104.69 | LED14.1-VDD 74.2,105.9 | C15.1 55.77,101.51 | LED15.1-VDD 49.96,97.41 | C16.1 40.17,81.35 | C17.1 43.42,55.77 | LED17.1-VDD 47.7,50 | C18.1 63.86,40.21 | LED18.1-VDD 70.9,39 | C19.1 89.38,43.34 | LED19.1-VDD 95.06,47.55 | LED31.1-VDD 115.56,59.18 | C31.1 113.46,53.4 | LED30.1-VDD 103.29,39.33 | C30.1 98.5,35.5 | LED29.1-VDD 82.69,28.23 | C29.1 v80.5,27.5 | LED28.1-VDD 59.03,28.8 | C28.1 53.06,31.22 | LED27.1-VDD 39,41.3 | C27.1 34.66,46.05 | LED26.1-VDD 27.94,62.29 | LED25.1-VDD 29.89,85.67 | C25.1 31.94,91.52 | LED24.1-VDD 41.87,105.44 | LED23.1-VDD 62.5,116.2 v64.5,117.5 C23.1 | LED22.1-VDD 85.82,115.35 | C22.1 91.39,113.18 | LED21.1-VDD 105.6,103.3 | C21.1 109.4,98.2 | LED20.1-VDD 116.35,82.51 | C33.1 127.17,90.68 | LED33.1-VDD 125.22,95.97 | C34.1 113.95,112.45 | LED34.1-VDD 109.7,116.4 | C35.1 92.74,126.48 | LED35.1-VDD 86.9,128.1 | C36.1 67.11,129.6 | LED36.1-VDD 61.31,129 | C37.1 42.86,121.71 | LED37.1-VDD 37.94,118.45 | C38.1 24.44,104.07 | LED38.1-VDD 21.29,98.97 | C39.1 v14.5,80.5 | C40.1 17.63,54.47 | LED40.1-VDD 19.41,48.77 | C41.1 30.88,32.2 30.94,32.15 | LED41.1-VDD 35.34,28.63 | C42.1 52.41,18.54 | LED42.1-VDD 57.8,16.4
  Top 0.5: C43.1 77.95,14.58 | LED43.1-VDD 83.83,15.58 | C44.1 102.39,22.52 | LED44.1-VDD 107.2,26.3 109.45,27.45 | C45.1 120.79,40.97 122.24,41.73 | LED45.1-VDD 124.4,45.34 | LED46.1-VDD 141.48,84.79 | C49.1 94.9,138.5 | LED49.1-VDD 87.59,140.57 | C50.1 67.7,142.19 | LED50.1-VDD 60.44,141.11 | C51.1 41.52,134.96 | LED51.1-VDD 35.1,131.3 | C52.1 20.02,118.49 | LED52.1-VDD 15.45,112.53 | C53.1 6.5,94.9 | LED53.1-VDD 4.51,87.73 | LED54.1-VDD 3.5,60.5 | C55.1 9.57,41.38 | LED55.1-VDD 13.26,34.92 | C56.1 26.23,19.81 26.41,19.61 27.5,18.5 | LED56.1-VDD 31.5,14.5 | C57.1 49.5,5.5 | LED57.1-VDD 56.71,3.49 | C58.1 77,2.5 | LED58.1-VDD 84.53,2.51 | C59.1 103.8,8.7 | LED59.1-VDD 109.92,12.87 | C60.1 125,26.07 | LED60.1-VDD 129.7,31.85 | C61.1 138.95,49.48 | LED61.1-VDD 141.54,56.81 | 65.65,74.75 LED4.1-VDD C4.1 | C1.1 LED1.1-VDD | C7.1 80.3,94 | 80.3,94 80.48,94.51 | 80.3,94 80.62,94.91 | LED7.1-VDD 74.1,96.4 74.07,96.4
  Top 1.5: v94.75,80.5 arc140 v50.25,80.5 | v50.25,64.5 arc140 v94.75,64.5
  Top 2: v106,80.5 arc152 v39,80.5 | v39,64.5 arc152 v106,64.5
  Top 2.5: v130.5,80.5 arc164 v14.5,80.5 | v27.5,80.5 arc-69 v64.5,117.5 | v80.5,117.5 arc-71 v117.5,80.5 | v117.5,64.5 arc-69 v80.5,27.5 | v64.5,27.5 arc-71 v27.5,64.5 | v2.5,80.5 arc-167 v142.5,80.5 | v142.5,64.5 arc-167 v2.5,64.5 | v14.5,64.5 arc164 v130.5,64.5
  Bottom 0.5: C6.1 v94.75,80.5 | C20.1 v117.5,80.5 | C46.1 v142.5,80.5 | C9.1 v50.25,64.5 | C26.1 v27.5,64.5 | C54.1 v2.5,64.5 | LED12.1-VDD v106,64.5 C12.1 | LED32.1-VDD v130.5,64.5 C32.1 | LED16.1-VDD v39,80.5 | LED39.1-VDD v14.5,80.5
  Bottom 2.5: v64.5,117.5 arc180 v80.5,117.5 | v64.5,27.5 arc-180 v80.5,27.5
  other vias: 91.65,75.88 113.29,76.07 138.29,77.1 53.35,69.12 31.71,68.93 6.69,68.21 103.95,70.85 127.45,70.85 41.05,74.15 17.55,74.15 74.95,70.85 79.35,70.05 74.95,79.35 70.05,65.65 65.65,74.95 101.43,64.75 125.49,65.52
  pour Bottom: 72.5,150.5 arc-180 72.5,-5.5 arc-180

### Text on the board
bPlace: Supply requirements: / 5 V / 3 A | DIN / DOUT | GND / +5V | Round LED light - 160 mm / 62 addressable RGBW LEDs / / Albert Seligmann / April 2020 | JLCJLCJLCJLC